# Altium schematic sheet High Level.SchDoc
size A2
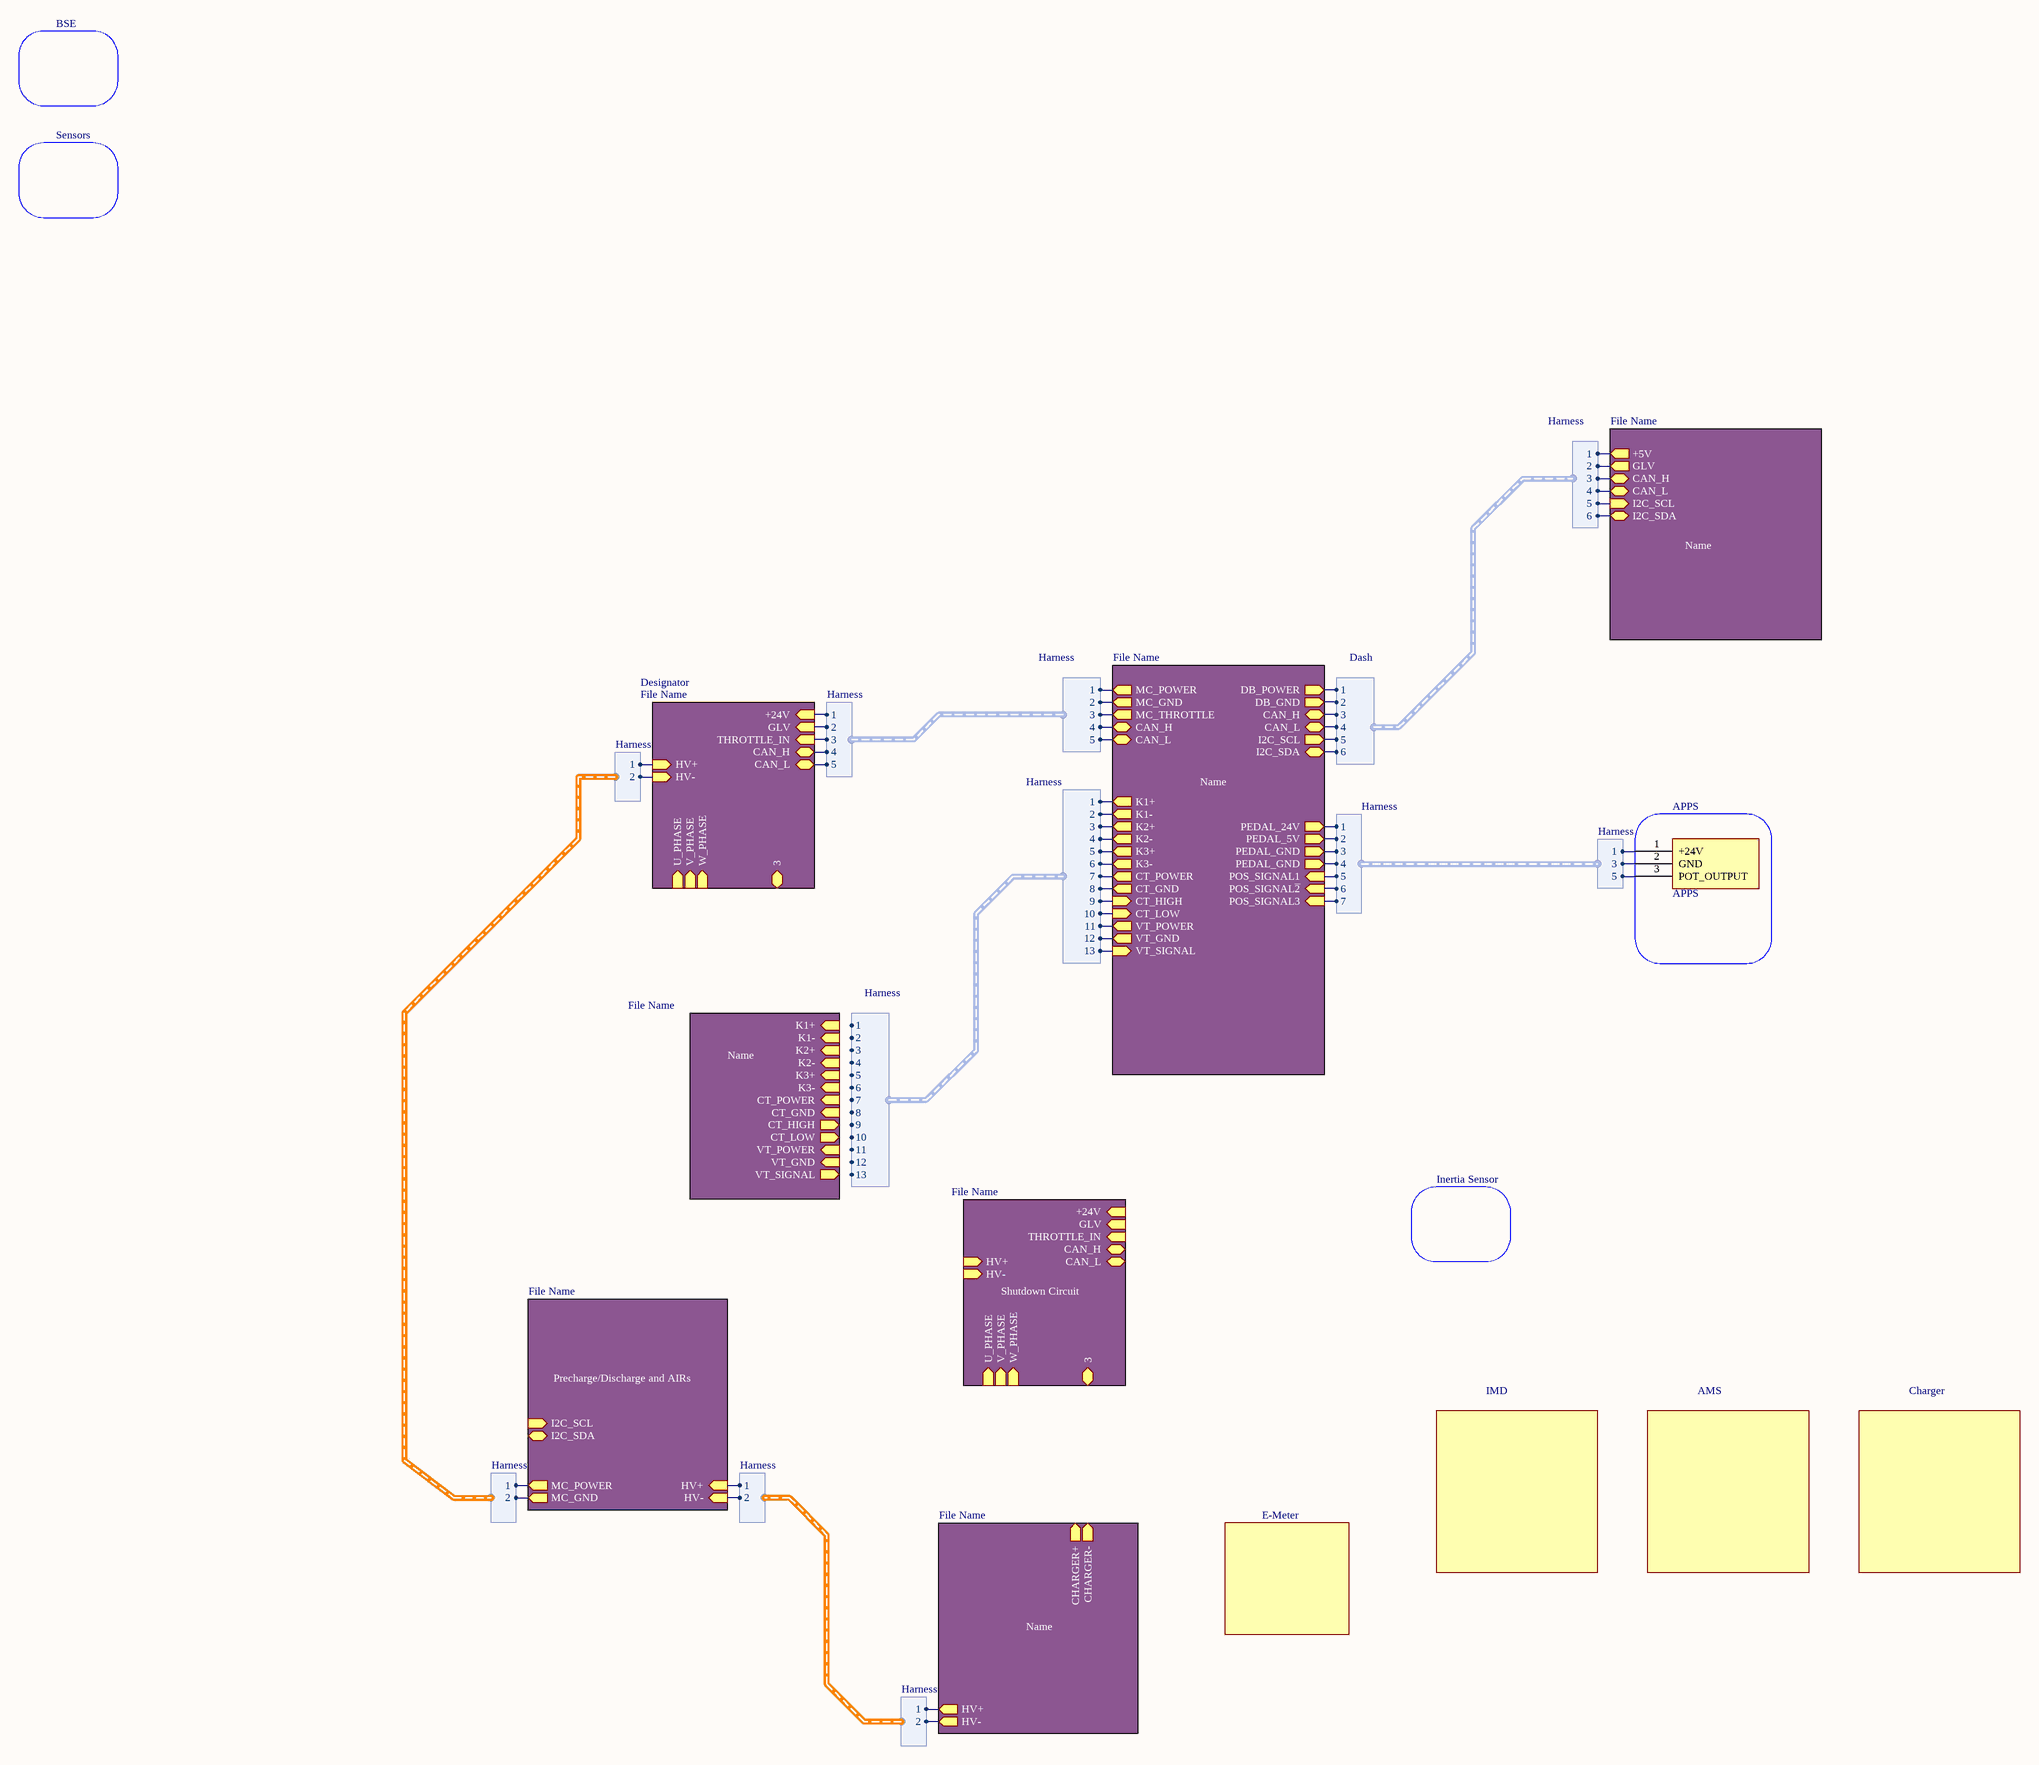
[diagram p0: High Level.SchDoc]

## Parts
APPS  APPS  (value not drawn)

## Blocks framed on the sheet
APPS: APPS

## Sub-sheets
Designator = File Name: +24V, GLV, THROTTLE_IN, 3, U_PHASE, V_PHASE, W_PHASE, HV-, HV+, CAN_H, CAN_L
Name = File Name: MC_POWER, MC_GND, MC_THROTTLE, CAN_H, CAN_L, DB_POWER, DB_GND, CAN_H, CAN_L, I2C_SCL, I2C_SDA, K1+, K1-, K2+, K2-, K3+, K3-, CT_POWER, CT_GND, CT_HIGH, CT_LOW, VT_POWER, VT_GND, VT_SIGNAL, PEDAL_24V, PEDAL_5V, PEDAL_GND, PEDAL_GND, POS_SIGNAL1, POS_SIGNAL~{2}, POS_SIGNAL3
Name = File Name: +5V, GLV, CAN_H, CAN_L, I2C_SCL, I2C_SDA
Name = File Name: K1+, K1-, K2+, K2-, K3+, K3-, CT_POWER, CT_GND, CT_HIGH, CT_LOW, VT_POWER, VT_GND, VT_SIGNAL
Name = File Name: HV+, HV-, CHARGER+, CHARGER-
Precharge/Discharge and AIRs = File Name: MC_POWER, I2C_SCL, I2C_SDA, MC_GND, HV+, HV-
Shutdown Circuit = File Name: +24V, GLV, THROTTLE_IN, 3, U_PHASE, V_PHASE, W_PHASE, HV-, HV+, CAN_H, CAN_L

## Harnesses
Harness: 1, 2, 3, 4, 5
Harness: 1, 2
Harness: 1, 2, 3, 4, 5, 6
Dash: 1, 2, 3, 4, 5, 6
Harness: 1, 2, 3, 4, 5, 6, 7, 8, 9, 10, 11, 12, 13
Harness: 1, 2, 3, 4, 5, 6, 7
Harness: 1, 3, 5

## Nets
NetAPPS_1: APPS.1(+24V) ; sheet Name/PEDAL_24V, harness Harness.1
NetAPPS_2: APPS.2(GND) ; sheet Name/PEDAL_GND, harness Harness.3
NetAPPS_3: APPS.3(POT_OUTPUT) ; sheet Name/POS_SIGNAL1, harness Harness.5
(unnamed): sheet Name/MC_POWER, sheet Designator/+24V, harness Harness.1
(unnamed): sheet Name/MC_GND, sheet Designator/GLV, harness Harness.2
(unnamed): sheet Name/MC_THROTTLE, sheet Designator/THROTTLE_IN, harness Harness.3
(unnamed): sheet Name/CAN_H, sheet Designator/CAN_H, harness Harness.4
(unnamed): sheet Name/CAN_L, sheet Designator/CAN_L, harness Harness.5
(unnamed): sheet Name/DB_POWER, sheet Name/+5V, harness Harness.1, harness Dash.1
(unnamed): sheet Name/DB_GND, sheet Name/GLV, harness Harness.2, harness Dash.2
(unnamed): sheet Name/CAN_H, sheet Name/CAN_H, harness Harness.3, harness Dash.3
(unnamed): sheet Name/CAN_L, sheet Name/CAN_L, harness Harness.4, harness Dash.4
(unnamed): sheet Name/I2C_SCL, sheet Name/I2C_SCL, harness Harness.5, harness Dash.5
(unnamed): sheet Name/I2C_SDA, sheet Name/I2C_SDA, harness Harness.6, harness Dash.6
(unnamed): sheet Name/K1+, harness Harness.1
(unnamed): sheet Name/K1-, harness Harness.2
(unnamed): sheet Name/K2+, harness Harness.3
(unnamed): sheet Name/K2-, harness Harness.4
(unnamed): sheet Name/K3+, harness Harness.5
(unnamed): sheet Name/K3-, harness Harness.6
(unnamed): sheet Name/CT_POWER, harness Harness.7
(unnamed): sheet Name/CT_GND, harness Harness.8
(unnamed): sheet Name/CT_HIGH, harness Harness.9
(unnamed): sheet Name/CT_LOW, harness Harness.10
(unnamed): sheet Name/VT_POWER, harness Harness.11
(unnamed): sheet Name/VT_GND, harness Harness.12
(unnamed): sheet Name/VT_SIGNAL, harness Harness.13
(unnamed): sheet Name/PEDAL_5V, harness Harness.2
(unnamed): sheet Name/PEDAL_GND, harness Harness.4
(unnamed): sheet Name/POS_SIGNAL~{2}, harness Harness.6
(unnamed): sheet Name/POS_SIGNAL3, harness Harness.7
(unnamed): sheet Designator/HV-, sheet Precharge/Discharge and AIRs/MC_GND, harness Harness.2
(unnamed): sheet Designator/HV+, sheet Precharge/Discharge and AIRs/MC_POWER, harness Harness.1
(unnamed): sheet Precharge/Discharge and AIRs/HV+, sheet Name/HV+, harness Harness.1
(unnamed): sheet Precharge/Discharge and AIRs/HV-, sheet Name/HV-, harness Harness.2

## Notes on the sheet
- BSE
- Sensors
- Inertia Sensor
- IMD
- AMS
- Charger
- E-Meter

## Library data of the parts
APPS = APPS: Accelerator Position Pedal System